# Altium schematic sheet MGTAVTT.SchDoc
size A4
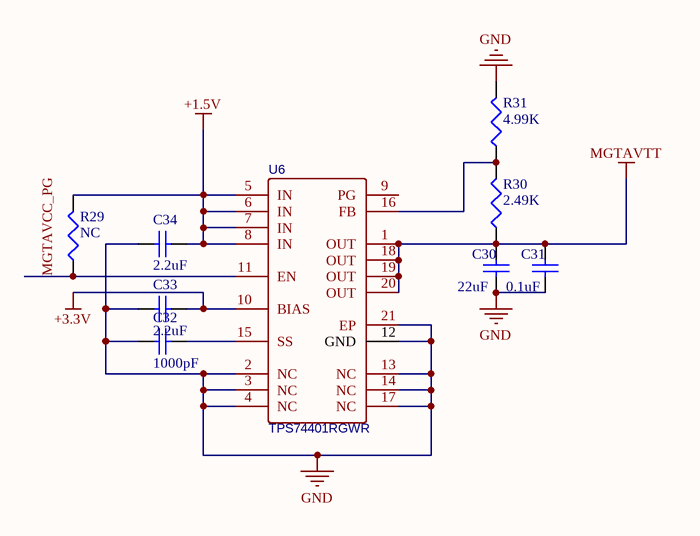
[diagram p0: MGTAVTT.SchDoc]

## Parts
C30  value 22uF  [C1210]  (hidden comment: Cap Semi)
C31  value 0.1uF  [C1210]  (hidden comment: Cap Semi)
C32  value 1000pF  [C1210]  (hidden comment: Cap Semi)
C33  value 2.2uF  [C1210]  (hidden comment: Cap Semi)
C34  value 2.2uF  [C1210]  (hidden comment: Cap Semi)
R29  value NC  [J1-0603]  (hidden comment: Res3)
R30  value 2.49K  [J1-0603]  (hidden comment: Res3)
R31  value 4.99K  [J1-0603]  (hidden comment: Res3)
U6  TPS74401RGWR  [VQFN-20_L5.0-W5.0-P0.65-TL-EP]

## Nets
+1.5V: C34.1 R29.2 U6.5(IN) U6.6(IN) U6.7(IN) U6.8(IN)
+3.3V: C33.1 U6.10(BIAS)
GND: C30.1 C31.1 C32.2 C33.2 C34.2 R31.2 U6.2(NC) U6.3(NC) U6.4(NC) U6.12(GND) U6.13(NC) U6.14(NC) U6.17(NC) U6.21(EP)
MGTAVTT: C30.2 C31.2 R30.1 U6.1(OUT) U6.18(OUT) U6.19(OUT) U6.20(OUT)
MGTAVCC_PG: R29.1 U6.11(EN)
NetC32_1: C32.1 U6.15(SS)
NetR30_2: R30.2 R31.1 U6.16(FB)

Not connected (* = marked no-connect by the designer): U6 9(PG)

## Library data of the parts
C30-C34 = Cap Semi: Capacitor (Semiconductor SIM Model); Published: 8-Jun-2000; LatestRevisionDate: 29-May-2009; LatestRevisionNote: IPC-7351 Footprint Added.; PackageReference: C1206; Publisher: Altium Limited; PackageDescription: Chip Capacitor
R29-R31 = Res3: Resistor; Published: 8-Jun-2000; LatestRevisionDate: 29-May-2009; LatestRevisionNote: IPC-7351 Footprint Added.; PackageReference: J1-0603; Publisher: Altium Limited; PackageDescription: Chip Resistor
U6 = TPS74401RGWR: BOM_Manufacturer: TI; Contributor: LCSC; BOM_Supplier: LCSC; BOM_Manufacturer Part: TPS74401RGWR; BOM_Supplier Part: C138728; spicePre: U; spiceSymbolName: TPS74401RGWR